# EAGLE design AESP_One_01 (EAGLE 7.3.0)
LAST_DATE: 01_07_2015
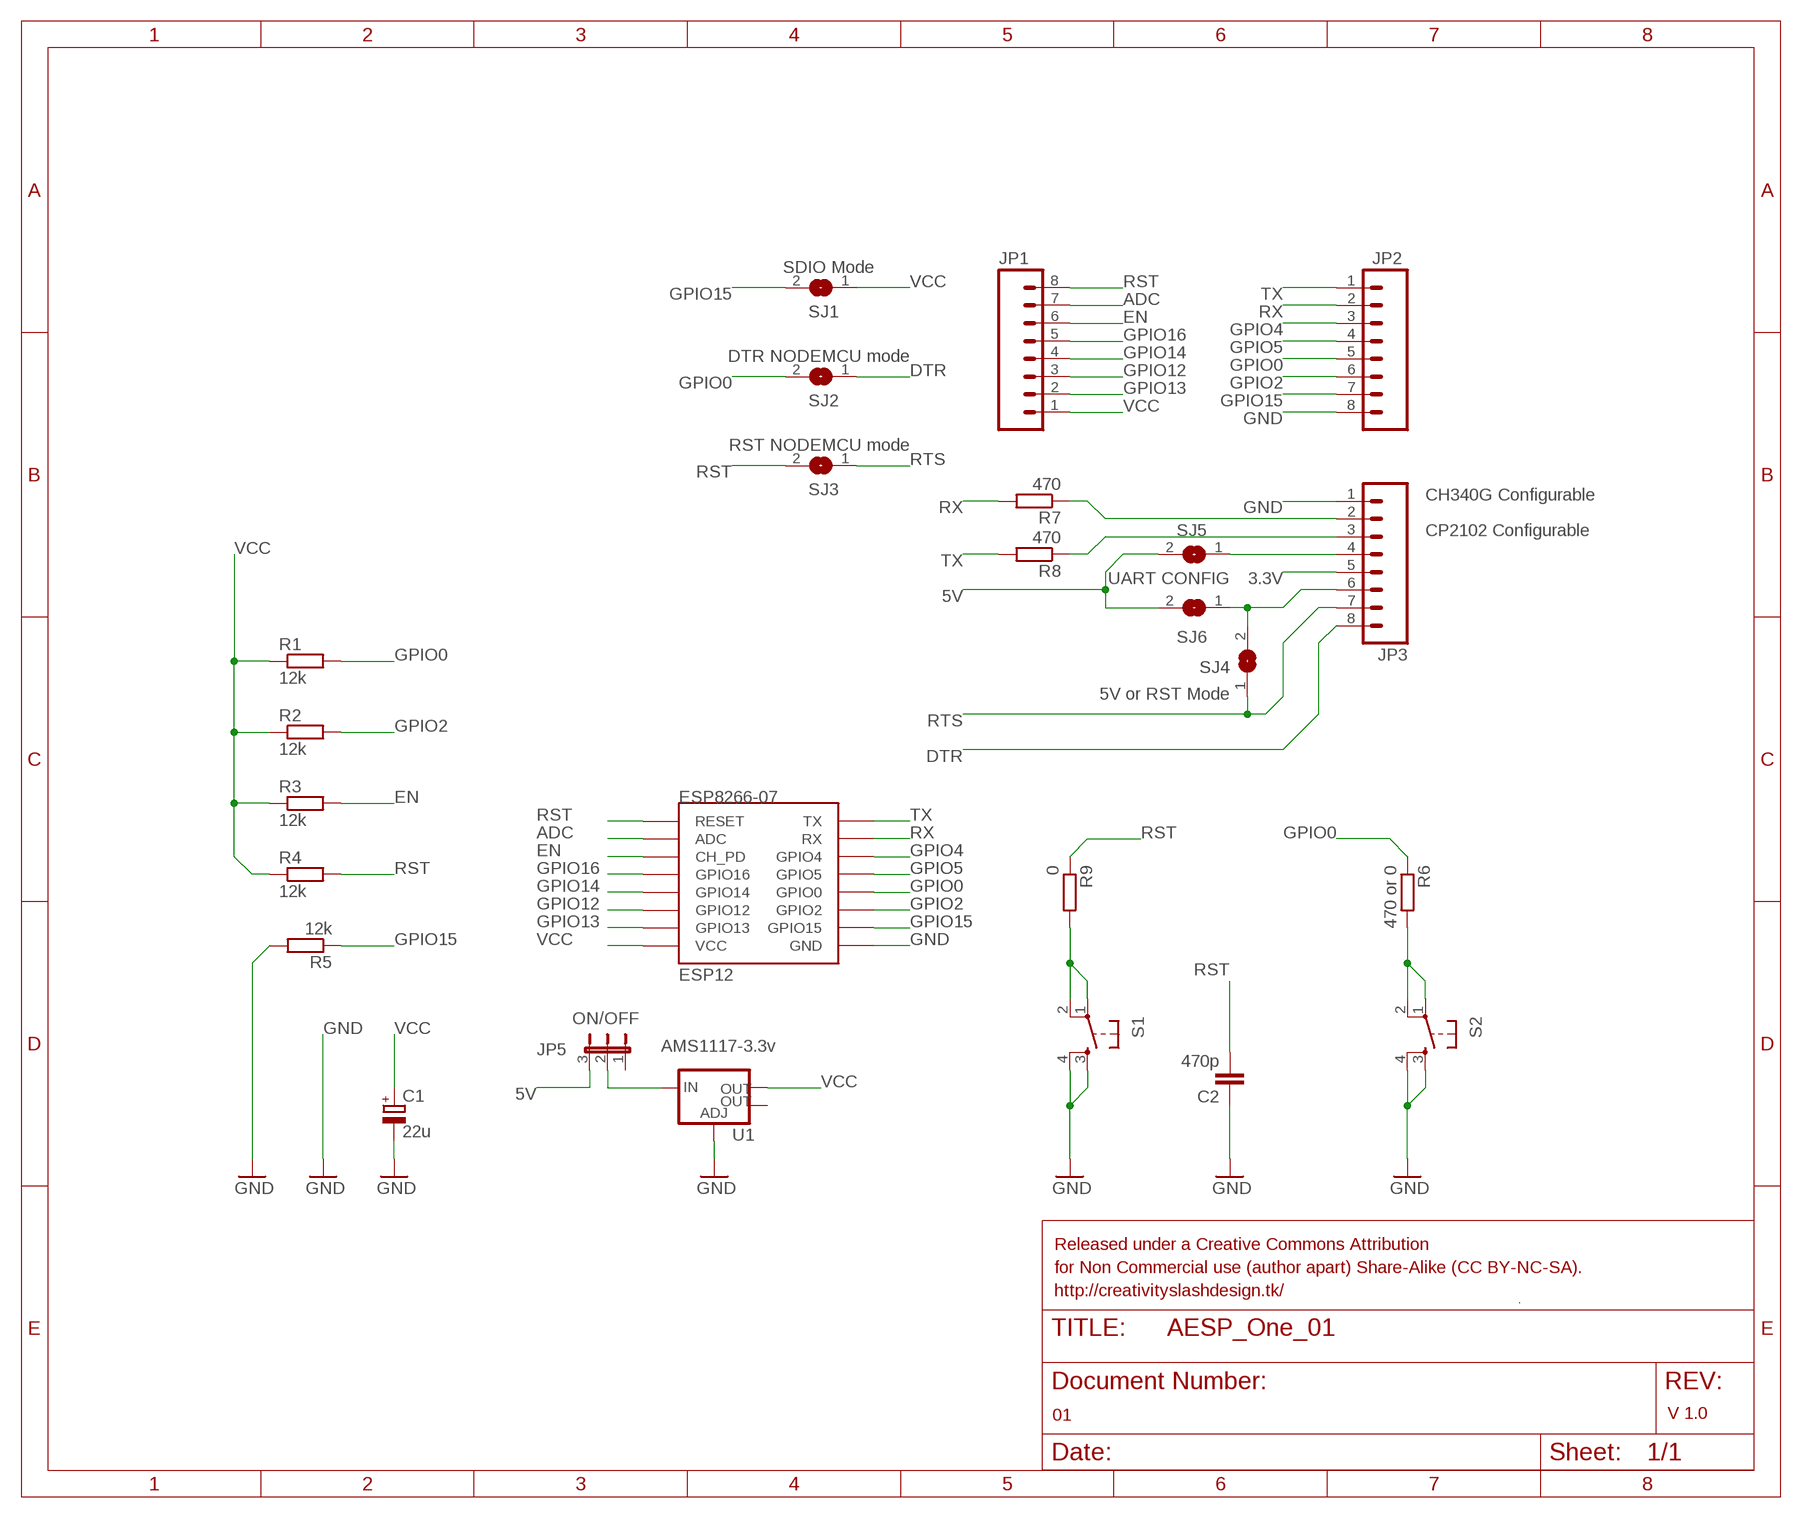
[diagram p0: schematic, sheet 1]

## Parts
C1  22u  CPOL-EU140CLH-0810  [140CLH-0810]
C2  470p  C-EUC0805  [C0805]
ESP8266-07  ESP12  [ESP12]
JP1  M08LONGPADS  [1X08_LONGPADS]
JP2  M08LONGPADS  [1X08_LONGPADS]
JP3  M08LONGPADS  [1X08_LONGPADS]
JP5  ON/OFF  JP2W  [JP2W]
R1  12k  R-EU_M0805  [M0805]
R2  12k  R-EU_M0805  [M0805]
R3  12k  R-EU_M0805  [M0805]
R4  12k  R-EU_M0805  [M0805]
R5  12k  R-EU_M0805  [M0805]
R6  470 or 0  R-EU_M0805  [M0805]
R7  470  R-EU_M0805  [M0805]
R8  470  R-EU_M0805  [M0805]
R9  0  R-EU_M0805  [M0805]
S1  TAC_SWITCHSMD  [TACTILE-SWITCH-SMD]
S2  TAC_SWITCHSMD  [TACTILE-SWITCH-SMD]
SJ1  SDIO Mode  SJ  [SJ]
SJ2  DTR NODEMCU mode  SJ  [SJ]
SJ3  RST NODEMCU mode  SJ  [SJ]
SJ4  5V or RST Mode  SJ  [SJ]
SJ5  SJ  [SJ]
SJ6  SJ  [SJ]
U1  AMS1117-3.3v  V_REG_LM1117SOT223  [SOT223]

## Nets
3.3V: JP3.5
5V: JP5.3 SJ5.2 SJ6.2
ADC: ESP8266-07.ADC JP1.7
DTR: JP3.8 SJ2.1
EN: ESP8266-07.CH_PD JP1.6 R3.2
GND: C1.- C2.1 ESP8266-07.GND JP2.8 JP3.1 R5.2 S1.3 S1.4 S2.3 S2.4 U1.1(ADJ)
GPIO0: ESP8266-07.GPIO0 JP2.5 R1.2 R6.1 SJ2.2
GPIO2: ESP8266-07.GPIO2 JP2.6 R2.2
GPIO4: ESP8266-07.GPIO4 JP2.3
GPIO5: ESP8266-07.GPIO5 JP2.4
GPIO12: ESP8266-07.GPIO12 JP1.3
GPIO13: ESP8266-07.GPIO13 JP1.2
GPIO14: ESP8266-07.GPIO14 JP1.4
GPIO15: ESP8266-07.GPIO15 JP2.7 R5.1 SJ1.2
GPIO16: ESP8266-07.GPIO16 JP1.5
N$1: R6.2 S2.1 S2.2
N$2: R9.2 S1.1 S1.2
N$4: JP3.3 R8.1
N$6: JP5.2 U1.3(IN)
N$7: JP3.4 SJ5.1
N$8: JP3.6 SJ4.2 SJ6.1
N$9: JP3.2 R7.1
RST: C2.2 ESP8266-07.RESET JP1.8 R4.2 R9.1 SJ3.2
RTS: JP3.7 SJ3.1 SJ4.1
RX: ESP8266-07.RX JP2.2 R7.2
TX: ESP8266-07.TX JP2.1 R8.2
VCC: C1.+ ESP8266-07.VCC JP1.1 R1.1 R2.1 R3.1 R4.1 SJ1.1 U1.2(OUT)
Unconnected: JP5.1 U1.4(OUT)

## Notes on the sheet
- CH340G Configurable
- CP2102 Configurable
- UART CONFIG
- Released under a Creative Commons Attribution
- for Non Commercial use (author apart) Share-Alike (CC BY-NC-SA).
- http://creativityslashdesign.tk/
- 01 | V 1.0

## Library data of the parts
C1 = resistor:CPOL-EU: POLARIZED CAPACITOR, European symbol
C2 = resistor:C-EU: CAPACITOR, European symbol
ESP8266-07 = esp8266modules:ESP12: ESP8266 Wifi module 12
JP1-JP3 = SparkFun-Connectors:M08: Header 8 Standard 8-pin 0.1" header. Use with straight break away headers (SKU : PRT-00116), right angle break away headers (PRT-00553), swiss pins (PRT-00743), machine pins (PRT-00117), and female headers (PRT-00115).
JP5 = jumper:JP2W: JUMPER
R1-R9 = resistor:R-EU_: RESISTOR, European symbol
S1 S2 = SparkFun-Retired:TAC_SWITCH: Momentary Switch Button commonly used for reset or general input. Spark Fun Electronics SKU : COM-00097 SMT- SWCH-08247; PROD_ID: SWCH-08247
SJ1-SJ6 = jumper:SJ: SMD solder JUMPER
U1 = SparkFun-PowerIC:V_REG_LM1117: Voltage Regulator LM1117 Standard adjustable voltage regulator but in SMD form. Spark Fun Electronics SKU : COM-00595; PROD_ID: VREG-08170

## Board
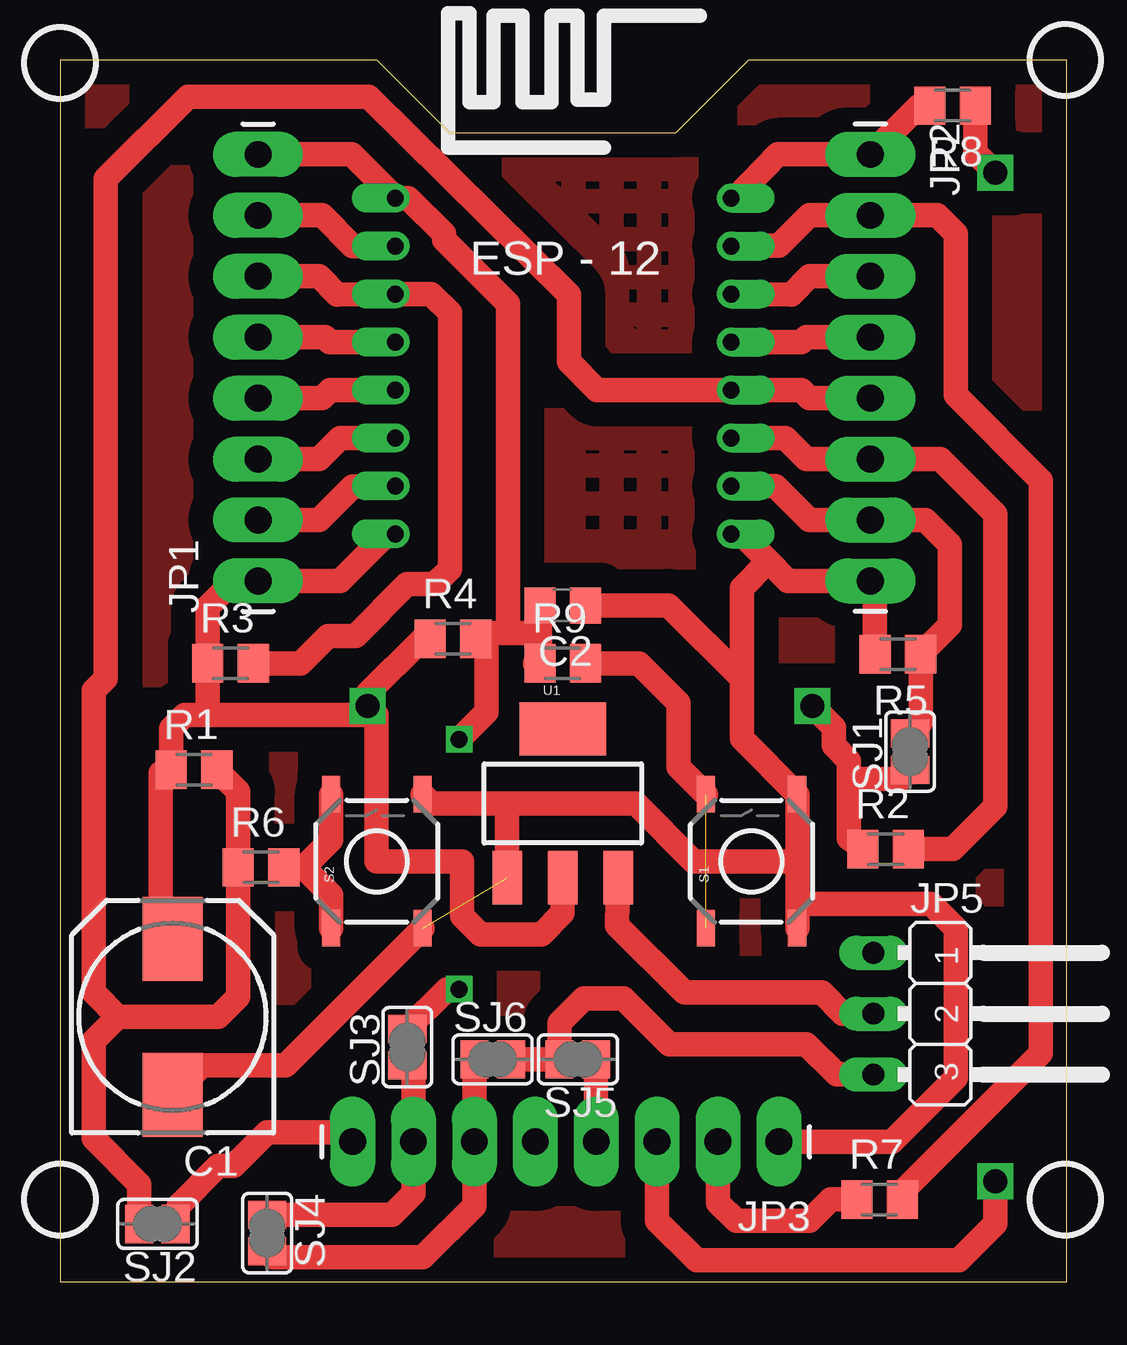
[diagram p1: board, top side]
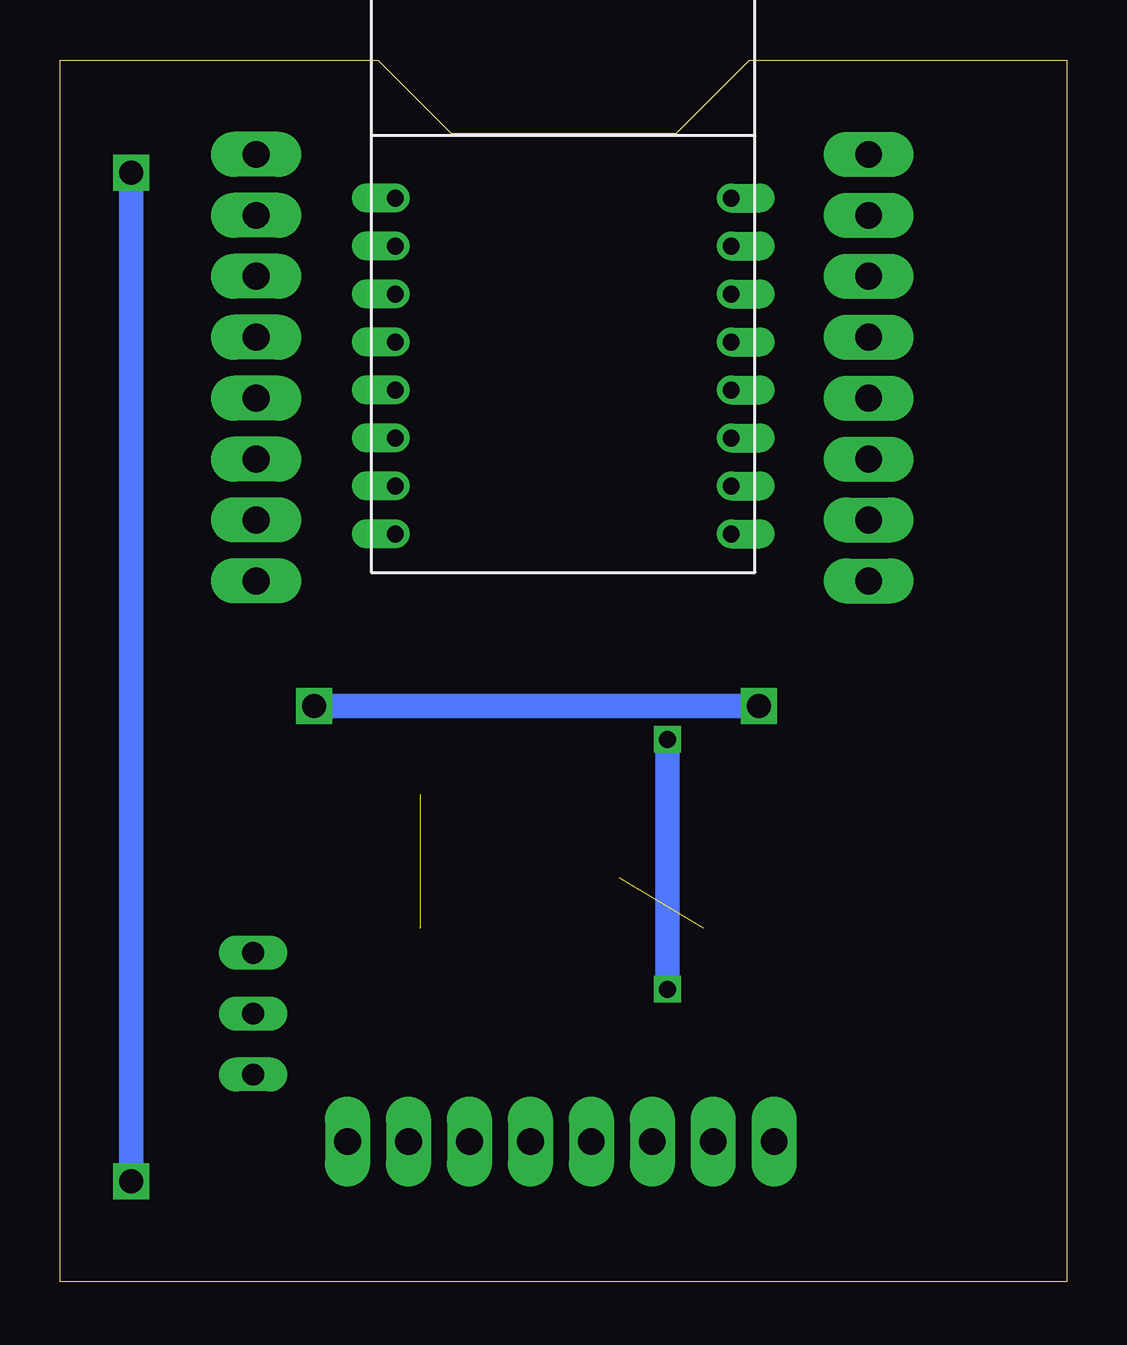
[diagram p2: board, bottom side, seen from below]

Size 41.96 x 50.93 mm. Coordinates in mm from the lower left corner, seen from the top.
Outline: 0,0 41.96,0 41.96,50.92 28.7,50.93 25.65,47.88 16.26,47.88 13.22,50.92 0,50.92 0,0
Copper layers (1*16): Top 0.035mm / dielectric 1.5mm / Bottom 0.035mm
Design rules "default": minimum track width 10mil, minimum drill 24mil, track to track 8mil, track to pad 8mil, pad to pad 8mil, via to via 8mil, smd to smd 8mil, copper to edge 40mil, drill to drill 8mil, minimum pad ring 10mil, minimum via ring 8mil, stop-mask expansion 4mil, vias tented up to drill 0mil, thermal gap 10mil

### Footprints (pad centres in the part's own frame; a part is rotated, then mirrored left to right if it is on the bottom)
140CLH-0810 = smd 3.5 x 2.5: + 3.25,0; - -3.25,0
C0805 = smd 1.3 x 1.5: 1 -0.95,0; 2 0.95,0
ESP12 = drill 0.7 offset: ADC -7.1,3.8; CH_PD -7.1,1.8; GND 6.9,-8.2; GPIO0 6.9,-2.2; GPIO2 6.9,-4.2; GPIO4 6.9,1.8; GPIO5 6.9,-0.2; GPIO12 -7.1,-4.2; GPIO13 -7.1,-6.2; GPIO14 -7.1,-2.2; GPIO15 6.9,-6.2; GPIO16 -7.1,-0.2; RESET -7.1,5.8; RX 6.9,3.8; TX 6.9,5.8; VCC -7.1,-8.2
1X08_LONGPADS = drill 1.118 pad 1.88 long: 1 0,0; 2 2.54,0; 3 5.08,0; 4 7.62,0; 5 10.16,0; 6 12.7,0; 7 15.24,0; 8 17.78,0
JP2W = drill 0.914 long: 1 -2.54,-1.27; 2 0,-1.27; 3 2.54,-1.27
M0805 = smd 1.3 x 1.6: 1 -0.95,0; 2 0.95,0
TACTILE-SWITCH-SMD = smd 1.524 x 0.762: 1 -2.794,1.905; 2 2.794,1.905; 3 -2.794,-1.905; 4 2.794,-1.905
SJ = smd 1.168 x 1.6: 1 -0.762,0; 2 0.762,0
SOT223 = smd 1.219 x 2.235: 1 -2.311,-3.099; 2 0,-3.099; 3 2.311,-3.099 | smd 3.6 x 2.2: 4 0,3.099

### Placement (x,y rotation side)
C1  4.7,11.05 90 top
C2  20.95,28.19 180 top
ESP8266-07  21.08,39.37 0 top
JP1  8.26,29.21 90 top
JP2  33.78,46.99 270 top
JP3  29.97,5.84 180 top
JP5  35.18,11.18 270 top
R1  5.59,21.34 0 top
R2  34.42,18.03 0 top
R3  7.11,25.78 0 top
R4  16.38,26.8 0 top
R5  34.93,26.16 180 top
R6  8.38,17.27 0 top
R7  34.16,3.43 0 top
R8  37.21,49.02 180 top
R9  20.95,25.78 0 top
S1  28.83,17.53 90 top
S2  13.21,17.53 90 top
SJ1  35.43,22.1 90 top
SJ2  4.06,2.41 180 top
SJ3  14.48,9.78 90 top
SJ4  8.64,2.03 270 top
SJ5  21.59,9.27 180 top
SJ6  18.03,9.27 0 top
U1  20.95,19.94 0 top

### Tracks (layer width: path | path; a pad name or v marks a point on that pad's centre or on a via)
5V
  Top 1.016: JP5.3 32.39,8.64 31.11,9.91 25.4,9.91 23.49,11.81 21.84,11.81 20.83,10.79 SJ5.2 SJ6.2
ADC
  Top 1.016: ESP8266-07.ADC 12.2,43.17 10.92,44.45 JP1.7
DTR
  Top 1.016: SJ2.1 4.95,3.17 6.6,4.83 7.24,4.83 8.64,6.22 11.81,6.22 JP3.8
EN
  Top 1.016: JP1.6 10.79,41.91 11.56,41.15 ESP8266-07.CH_PD 15.47,41.17 16.26,40.39 16.26,29.72 15.62,29.08 14.48,29.08 12.32,26.92 11.18,26.92 10.03,25.78 R3.2
GND  (1 unrouted)
  Top 1.016: S1.3 30.73,15.75 | 30.73,15.75 30.73,17.53 | 30.73,17.53 S1.4 28.42,22.64 28.42,25.15 | S2.4 15.49,19.94 18.67,19.94 | 18.67,19.94 24,19.94 26.42,17.53 30.73,17.53 | U1.1 18.64,19.41 18.67,19.94 | JP3.1 34.67,5.84 37.34,8.51 37.34,14.73 36.32,15.75 30.73,15.75 | 29.46,30.1 30.35,29.21 JP2.8 33.98,29.21 R5.2 | 29.46,30.1 28.45,31.11 ESP8266-07.GND | 29.46,30.1 29.46,29.97 28.42,28.93 28.42,25.15 | C2.1 25.37,28.19 28.42,25.15 | S2.3 9.4,9.02 5.92,9.02 C1.-
GPIO0
  Top 1.016: JP2.5 31.24,36.83 30.9,37.17 ESP8266-07.GPIO0 22.39,37.17 21.21,38.35 21.21,41.15 12.87,49.4 5.33,49.4 1.91,45.97 1.91,25.15 1.4,24.64 1.4,12.06 2.41,11.05 | 2.41,11.05 6.6,11.05 7.43,11.88 R6.1 7.43,20.44 R1.2 | SJ2.2 3.3,4.06 1.4,5.97 1.4,10.03 2.41,11.05
GPIO2
  Top 1.016: ESP8266-07.GPIO2 30.23,35.17 31.11,34.29 JP2.6 36.7,34.29 38.99,32 38.99,19.81 37.21,18.03 R2.2
GPIO4
  Top 1.016: JP2.3 31.24,41.91 30.48,41.15 ESP8266-07.GPIO4
GPIO5
  Top 1.016: JP2.4 31.11,39.37 30.91,39.17 ESP8266-07.GPIO5
GPIO12
  Top 1.016: ESP8266-07.GPIO12 11.68,35.17 10.79,34.29 JP1.3
GPIO13
  Top 1.016: JP1.2 10.79,31.75 12.19,33.15 13.96,33.15 ESP8266-07.GPIO13
GPIO14
  Top 1.016: JP1.4 10.92,36.83 11.26,37.17 ESP8266-07.GPIO14
GPIO15
  Top 1.016: ESP8266-07.GPIO15 29.82,33.17 31.24,31.75 JP2.7 36.07,31.75 37.08,30.73 37.08,27.37 R5.1 35.88,23.3 SJ1.2
GPIO16
  Top 1.016: ESP8266-07.GPIO16 11.25,39.17 11.05,39.37 JP1.5
N$1
  Top 1.016: R6.2 10.16,17.27 | 10.16,17.27 11.3,18.41 S2.2 | S2.1 11.3,16.13 10.16,17.27
N$2  (1 unrouted)
  Top 1.016: S1.2 25.78,21.46 25.78,24.13 24.13,25.78 R9.2
N$3
  pour Top (isolate 1.016, no thermals, hatched): 0.25,50.67 0.38,50.8 13.46,50.8 16.26,48.01 25.78,48.01 25.78,48.13 28.7,51.05 42.04,51.05 42.16,50.93 42.16,1.78 42.04,0 0.13,0
N$4  (via drill 1)
  Top 1.016: v38.99,4.19 38.99,2.41 37.47,0.89 26.54,0.89 24.89,2.54 JP3.3 | v38.99,46.23 38.16,47.06 R8.1
  Bottom 1.016: v38.99,46.23 v38.99,4.19
N$6
  Top 1.016: JP5.2 32.64,11.18 31.75,12.06 26.04,12.06 23.22,14.86 U1.3
N$7
  Top 1.016: JP3.4 SJ5.1
N$8
  Top 1.016: SJ4.2 8.89,1.02 15.11,1.02 17.27,3.17 JP3.6 SJ6.1
N$9
  Top 1.016: R7.1 32.13,3.43 31.24,2.54 28.19,2.54 27.43,3.3 JP3.2
RST  (via drill 0.7)
  Top 1.016: 18.67,27.05 18.67,40.77 16,43.43 16,43.69 14.52,45.17 ESP8266-07.RESET 12.16,46.99 JP1.8 | C2.2 20,27.05 | 20,27.05 R9.1 19.81,25.78 | R4.2 17.46,27.05 17.78,27.05 | 17.78,27.05 18.67,27.05 | 18.67,27.05 20,27.05 | v16.64,22.61 17.78,23.75 17.78,27.05 | v16.64,12.19 16.13,12.19 SJ3.2
  Bottom 1.016: v16.64,22.61 v16.64,12.19
RTS
  Top 1.016: SJ4.1 13.84,2.79 14.73,3.68 JP3.7 14.73,9.02 SJ3.1
RX
  Top 1.016: ESP8266-07.RX 27.99,43.18 29.97,43.18 31.24,44.45 JP2.2 36.58,44.45 37.34,43.69 37.34,36.96 40.89,33.4 40.89,9.53 35.11,3.74 R7.2
TX
  Top 1.016: ESP8266-07.TX 28.15,45.17 29.93,46.99 JP2.1 35.81,49.02 R8.2
VCC  (via drill 1)
  Top 1.016: C1.+ 4.19,14.81 4.19,21.21 4.62,21.45 R1.1 4.64,23.05 5.21,23.62 6.16,23.62 | v12.83,24 13.21,23.62 13.21,17.53 16.76,17.53 16.76,15.24 17.53,14.48 20.07,14.48 20.95,15.37 U1.2 | ESP8266-07.VCC 13.64,31.17 11.68,29.21 JP1.1 7.24,29.21 6.16,28.13 R3.1 6.16,23.62 | v31.37,24 32.26,23.11 32.26,22.35 32.89,21.72 32.89,20.95 | 6.16,23.62 12.83,23.62 v12.83,24 | R4.1 15.37,26.73 15.11,26.8 12.83,24.51 v12.83,24 | R2.1 32.89,18.48 32.89,20.95 | SJ1.1 35.05,20.95 32.89,20.95
  Bottom 1.016: v31.37,24 v12.83,24